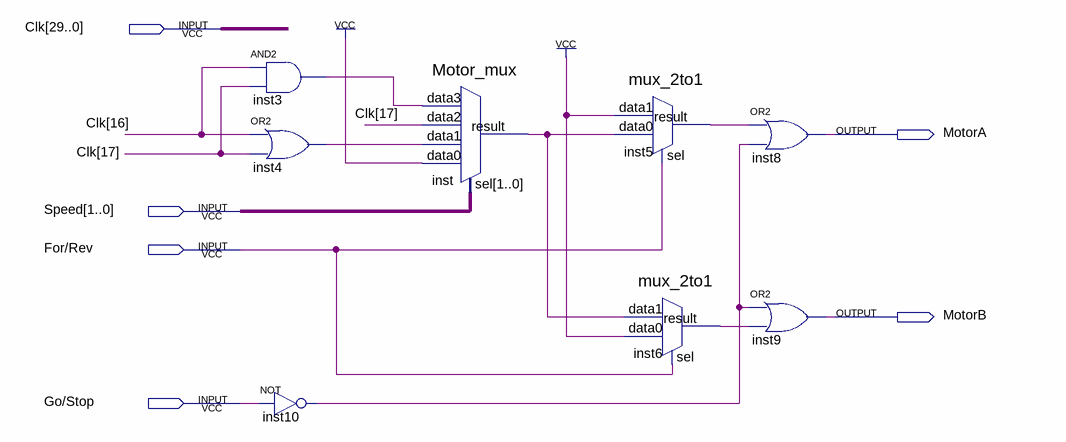
[diagram p0: schematic sheet]
// Quartus schematic Motor_Control.bdf as structural Verilog: 8 symbols, 6 pins
module Motor_Control (
  input  [29:0] Clk,
  input  [1:0] Speed,
  input  \For/Rev ,
  input  \Go/Stop ,
  output MotorA,
  output MotorB
);

  wire inst3_out, inst4_out, inst5_result, inst6_result, inst10_out, inst_result;

  and inst3 (inst3_out, Clk[16], Clk[17]);
  or inst4 (inst4_out, Clk[16], Clk[17]);
  not inst10 (inst10_out, \Go/Stop );
  Motor_mux inst (
    .data3(inst3_out), .data2(Clk[17]), .data1(inst4_out), .data0(1'b1), .sel(Speed), .result(inst_result));
  mux_2to1 inst5 (.data1(1'b1), .data0(inst_result), .sel(\For/Rev ), .result(inst5_result));
  mux_2to1 inst6 (.data1(inst_result), .data0(1'b1), .sel(\For/Rev ), .result(inst6_result));
  or inst8 (MotorA, inst5_result, inst10_out);
  or inst9 (MotorB, inst10_out, inst6_result);
endmodule
